# Altium schematic sheet connector.SchDoc
size A4
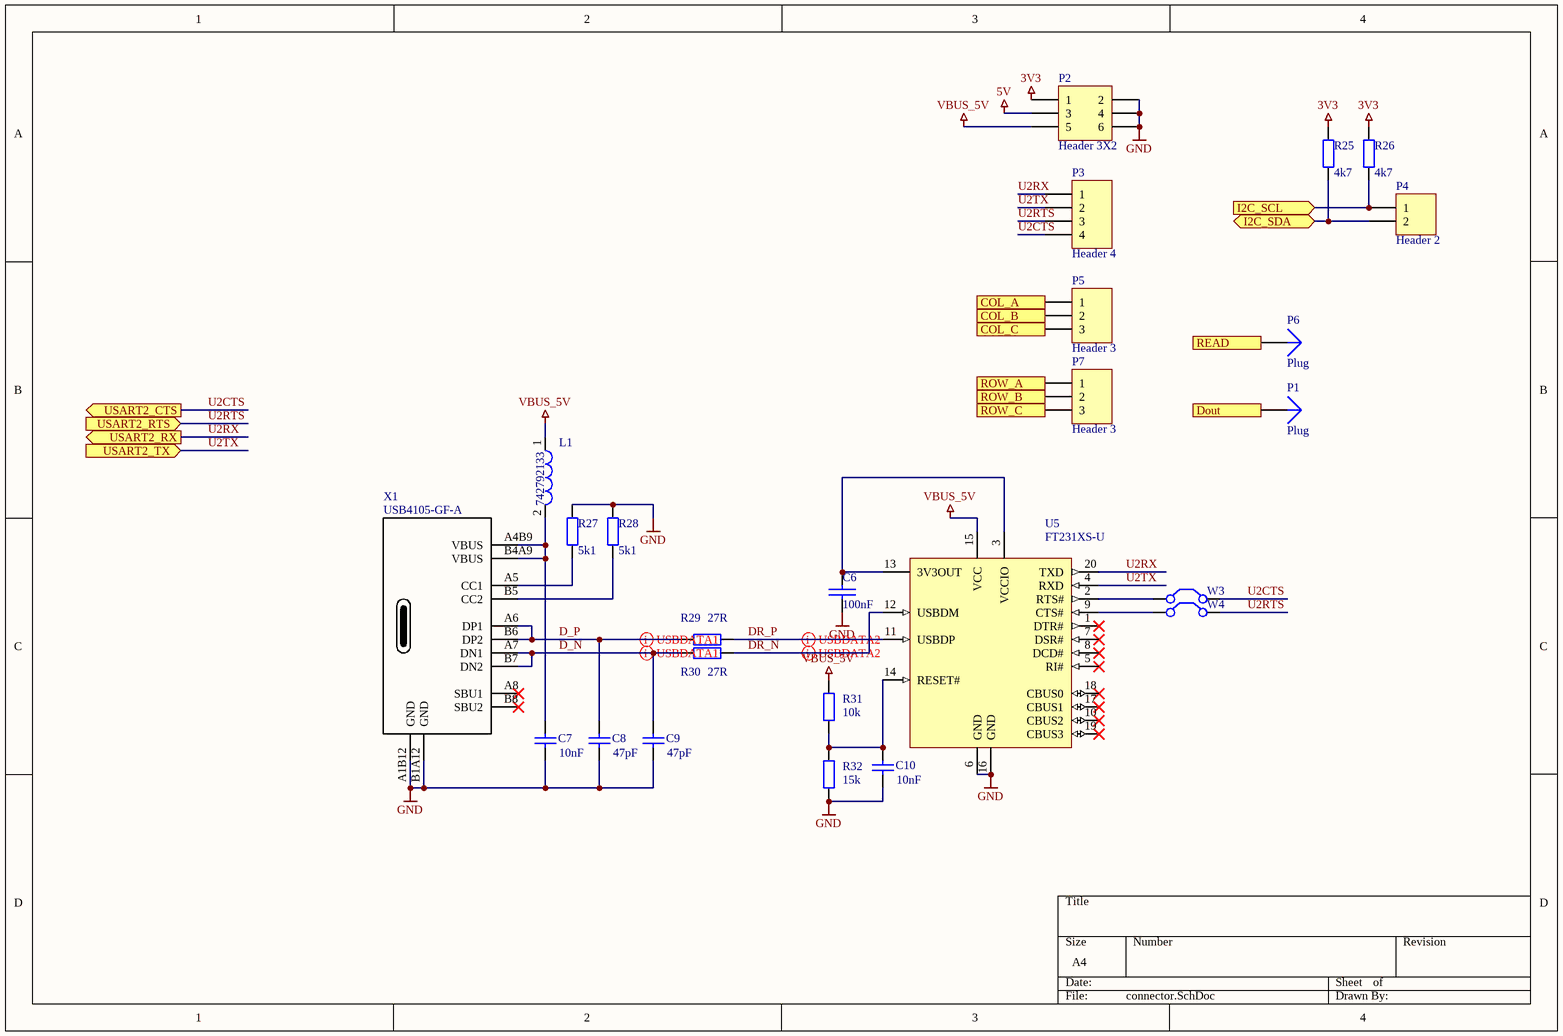
[diagram p0: connector.SchDoc]

## Parts
C6  100nF  [Cap_0805]
C7  10nF  [6-0805_L]
C8  47pF  [6-0805_L]
C9  47pF  [6-0805_L]
C10  10nF  [Cap_0805]
L1  742792133  [SMD-1206]
P1  Plug  [PIN1]
P2  Header 3X2  [HDR2X3]
P3  Header 4  [HDR1X4]
P4  Header 2  [HDR1X2]
P5  Header 3  [HDR1X3]
P6  Plug  [PIN1]
P7  Header 3  [HDR1X3]
R25  value 4k7  [RES_0805]  (hidden comment: 5k1)
R26  value 4k7  [RES_0805]  (hidden comment: 5k1)
R27  5k1  [RES_0805]
R28  5k1  [RES_0805]
R29  27R  [RES_0805]
R30  27R  [RES_0805]
R31  10k  [RES_0805]
R32  15k  [RES_0805]
U5  FT231XS-U  [SSOP-20_M]
W3  Jumper  [JUMPER]  (value not drawn)
W4  Jumper  [JUMPER]  (value not drawn)
X1  USB4105-GF-A  [GCT_USB4105-GF-A]

## Ports
COL_A (in), COL_B (in), COL_C (in), Dout (in), I2C_SCL (in), I2C_SDA (bidir), READ (in), ROW_A (in), ROW_B (in), ROW_C (in), USART2_CTS (out), USART2_RTS (in), USART2_RX (out), USART2_TX (in)

## Nets
3V3: P2.1 R25.2 R26.2
5V: P2.3
GND: C6.2 C7.1 C8.1 C9.1 C10.1 P2.2 P2.4 P2.6 R27.2 R28.2 R32.1 U5.6(GND) U5.16(GND) X1.A1B12(GND) X1.B1A12(GND)
VBUS_5V: L1.1 P2.5 R31.2 U5.15(VCC)
COL_A: P5.1 ; port COL_A
COL_B: P5.2 ; port COL_B
COL_C: P5.3 ; port COL_C
D_N: C9.2 R30.1 X1.A7(DN1) X1.B7(DN2)
D_P: C8.2 R29.1 X1.A6(DP1) X1.B6(DP2)
Dout: P1.1 ; port Dout
DR_N: R30.2 U5.12(USBDM)
DR_P: R29.2 U5.11(USBDP)
I2C_SCL: P4.1 R26.1 ; port I2C_SCL
I2C_SDA: P4.2 R25.1 ; port I2C_SDA
READ: P6.1 ; port READ
ROW_A: P7.1 ; port ROW_A
ROW_B: P7.2 ; port ROW_B
ROW_C: P7.3 ; port ROW_C
U2CTS: P3.4 W3.2(C2) ; port USART2_CTS
U2RTS: P3.3 W4.2(C2) ; port USART2_RTS
U2RX: P3.1 U5.20(TXD) ; port USART2_RX
U2TX: P3.2 U5.4(RXD) ; port USART2_TX
NetC6_1: C6.1 U5.3(VCCIO) U5.13(3V3OUT)
NetC7_2: C7.2 L1.2 X1.A4B9(VBUS) X1.B4A9(VBUS)
NetC10_2: C10.2 R31.1 R32.2 U5.14(RESET#)
NetR27_1: R27.1 X1.A5(CC1)
NetR28_1: R28.1 X1.B5(CC2)
NetU5_2: U5.2(RTS#) W3.1(C1)
NetU5_9: U5.9(CTS#) W4.1(C1)

Not connected (* = marked no-connect by the designer): U5 1(DTR#)* 5(RI#)* 7(DSR#)* 8(DCD#)* 10(CBUS2)* 17(CBUS1)* 18(CBUS0)* 19(CBUS3)*; X1 A8(SBU1)* B8(SBU2)*

## Layout directives
differential pair: D_N, D_P, DR_N, DR_P

## Library data of the parts
C6 = C: SDTSourceLibName: C:\WINDOWS\TEMP\DA.LIB; PCB Footprint: RC0805
C7-C10 = Cap: Capacitor; Published: 8-Jun-2000; LatestRevisionDate: 17-Jul-2002; LatestRevisionNote: Re-released for DXP Platform.; PackageReference: RAD-0.3; Publisher: Altium Limited; PackageDescription: Radial Cap, Thru-Hole; 2 Leads; 0.3 in Pin Spacing
  C7 C10: Value: 10nF
  C8 C9: Value: 47pF
L1 = CMP-0220-00010-1: SMD EMI Suppression Ferrite Bead WE-CBF, Z = 600 Ohm; Impedance: 600 Ohm; ComponentLink1Description: Manufacturer Link; DatasheetVersion: ver 2, Aug-2007; ComponentLink1URL: http://www.we-online.com; PackageDescription: Chip Inductor, 2-Leads, Body 3.2 x 1.6 mm; ComponentLink2URL: http://www.we-online.de/katalog/media/pdf/742792133.pdf; PackageVersion: 2007; PackageReference: SMD-1206; ComponentLink2Description: Datasheet
P2 = Header 3X2: Header, 3-Pin, Dual row; LatestRevisionDate: 17-Jul-2002; LatestRevisionNote: Re-released for DXP Platform.; Publisher: Altium Limited
P3 = Header 4: Header, 4-Pin; LatestRevisionDate: 17-Jul-2002; LatestRevisionNote: Re-released for DXP Platform.; Publisher: Altium Limited
P4 = Header 2: Header, 2-Pin; LatestRevisionDate: 17-Jul-2002; LatestRevisionNote: Re-released for DXP Platform.; Publisher: Altium Limited
P5 P7 = Header 3: Header, 3-Pin; LatestRevisionDate: 17-Jul-2002; LatestRevisionNote: Re-released for DXP Platform.; Publisher: Altium Limited
R25-R32 = Res2: Res 0805; Published: 8-Jun-2000; LatestRevisionDate: 17-Jul-2002; LatestRevisionNote: Re-released for DXP Platform.; PackageReference: AXIAL-0.4; Publisher: Altium Limited; PackageDescription: Axial Device, Thru-Hole; 2 Leads; 0.4 in Pin Spacing
  R27 R28: Value: 5k1
  R29 R30: Value: 27R
  R31: Value: 10k
  R32: Value: 15k
U5 = CMP-0248-00015-2: USB to Full-Handshake UART Interface Chip, UHCI/OHCI/EHCI Compatible, USB 2.0 Compatible, -40 to +85 degC, 20-Pin SSOP, Pb-Free, Tube; Manufacturer: FTDI; PackageDescription: 20-Pin Small Outline Package, 8.6 x 3.9 mm Body, 0.635 mm Pitch; ComponentLink2Description: Datasheet; DatasheetVersion: ver 1.2, Feb-2013; PackageReference: SSOP-20; ComponentLink3URL: www.ftdichip.com/Products/ICs/FT231X.html; ComponentLink2URL: http://www.ftdichip.com/Support/Documents/DataSheets/ICs/DS_FT231X.pdf; PartNumber: FT231XS-U; ComponentLink3Description: FT231X Product Page; ComponentLink1URL: http://www.ftdichip.com/; Code_JEDEC: MO-137-AD; ComponentLink1Description: Manufacturer URL; RevisionNote: DatasheetVersion updated to 1.2 Feb-2013; PackageVersion: Feb-13
W3 W4 = Jumper: Jumper Wire; Published: 24-Mar-1999; LatestRevisionDate: 17-Jul-2002; LatestRevisionNote: Re-released for DXP Platform.; PackageReference: RAD-0.2; Publisher: Altium Limited; PackageDescription: Radial Cap, Thru-Hole; 2 Leads; 0.2 in Pin Spacing
X1 = USB-C Type 2.0: USB4105-GF-A USB connector; ComponentLink1Description: LCSC  C319148; ComponentLink1URL: https://lcsc.com/product-detail/USB-Connectors_XKB-Connectivity-U262-161N-4BVC11_C319148.html; Supplier 1: LCSC; Supplier Part Number 1: C319148
P1 P6 = Plug: LatestRevisionDate: 17-Jul-2002; LatestRevisionNote: Re-released for DXP Platform.; Publisher: Altium Limited